# EAGLE design decoder (EAGLE 9.6.2)
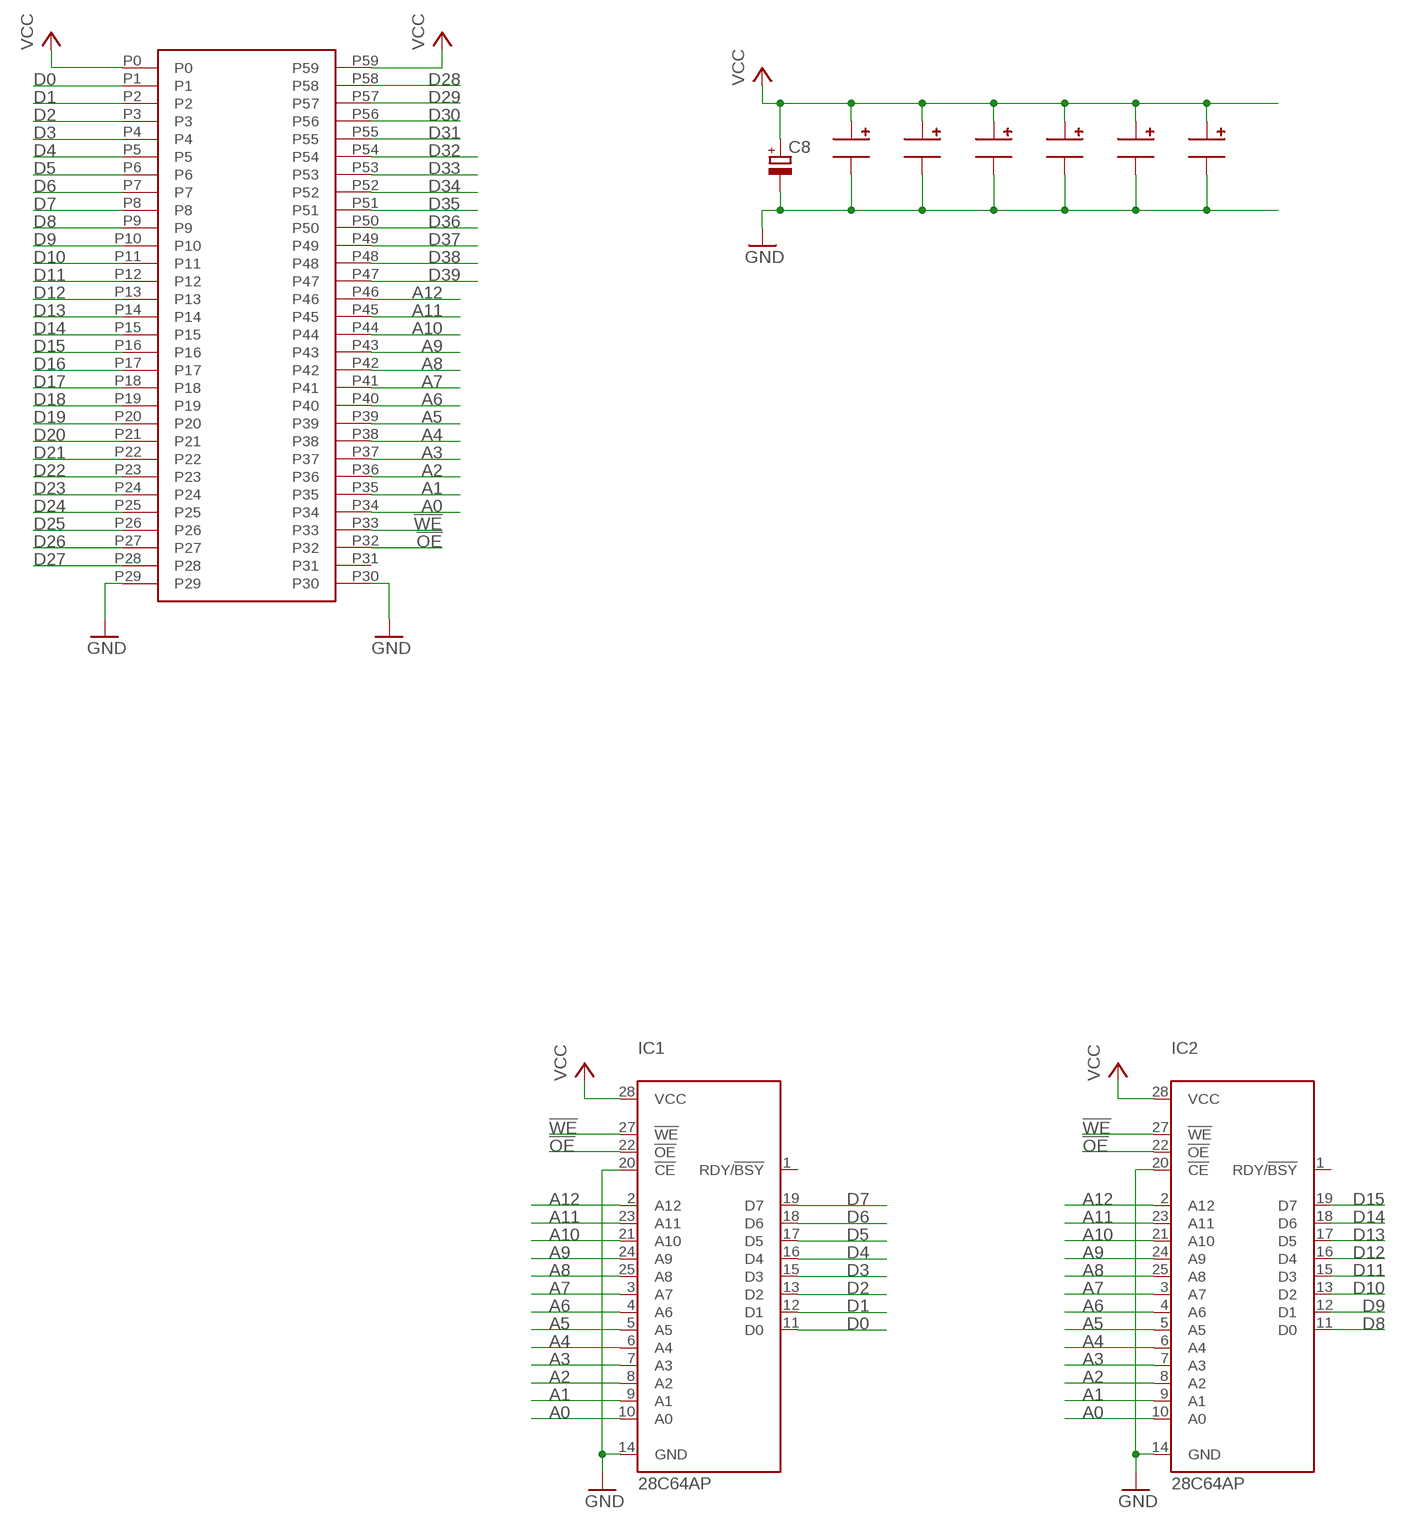
[diagram p0: schematic, sheet 1, part 1 of 2]
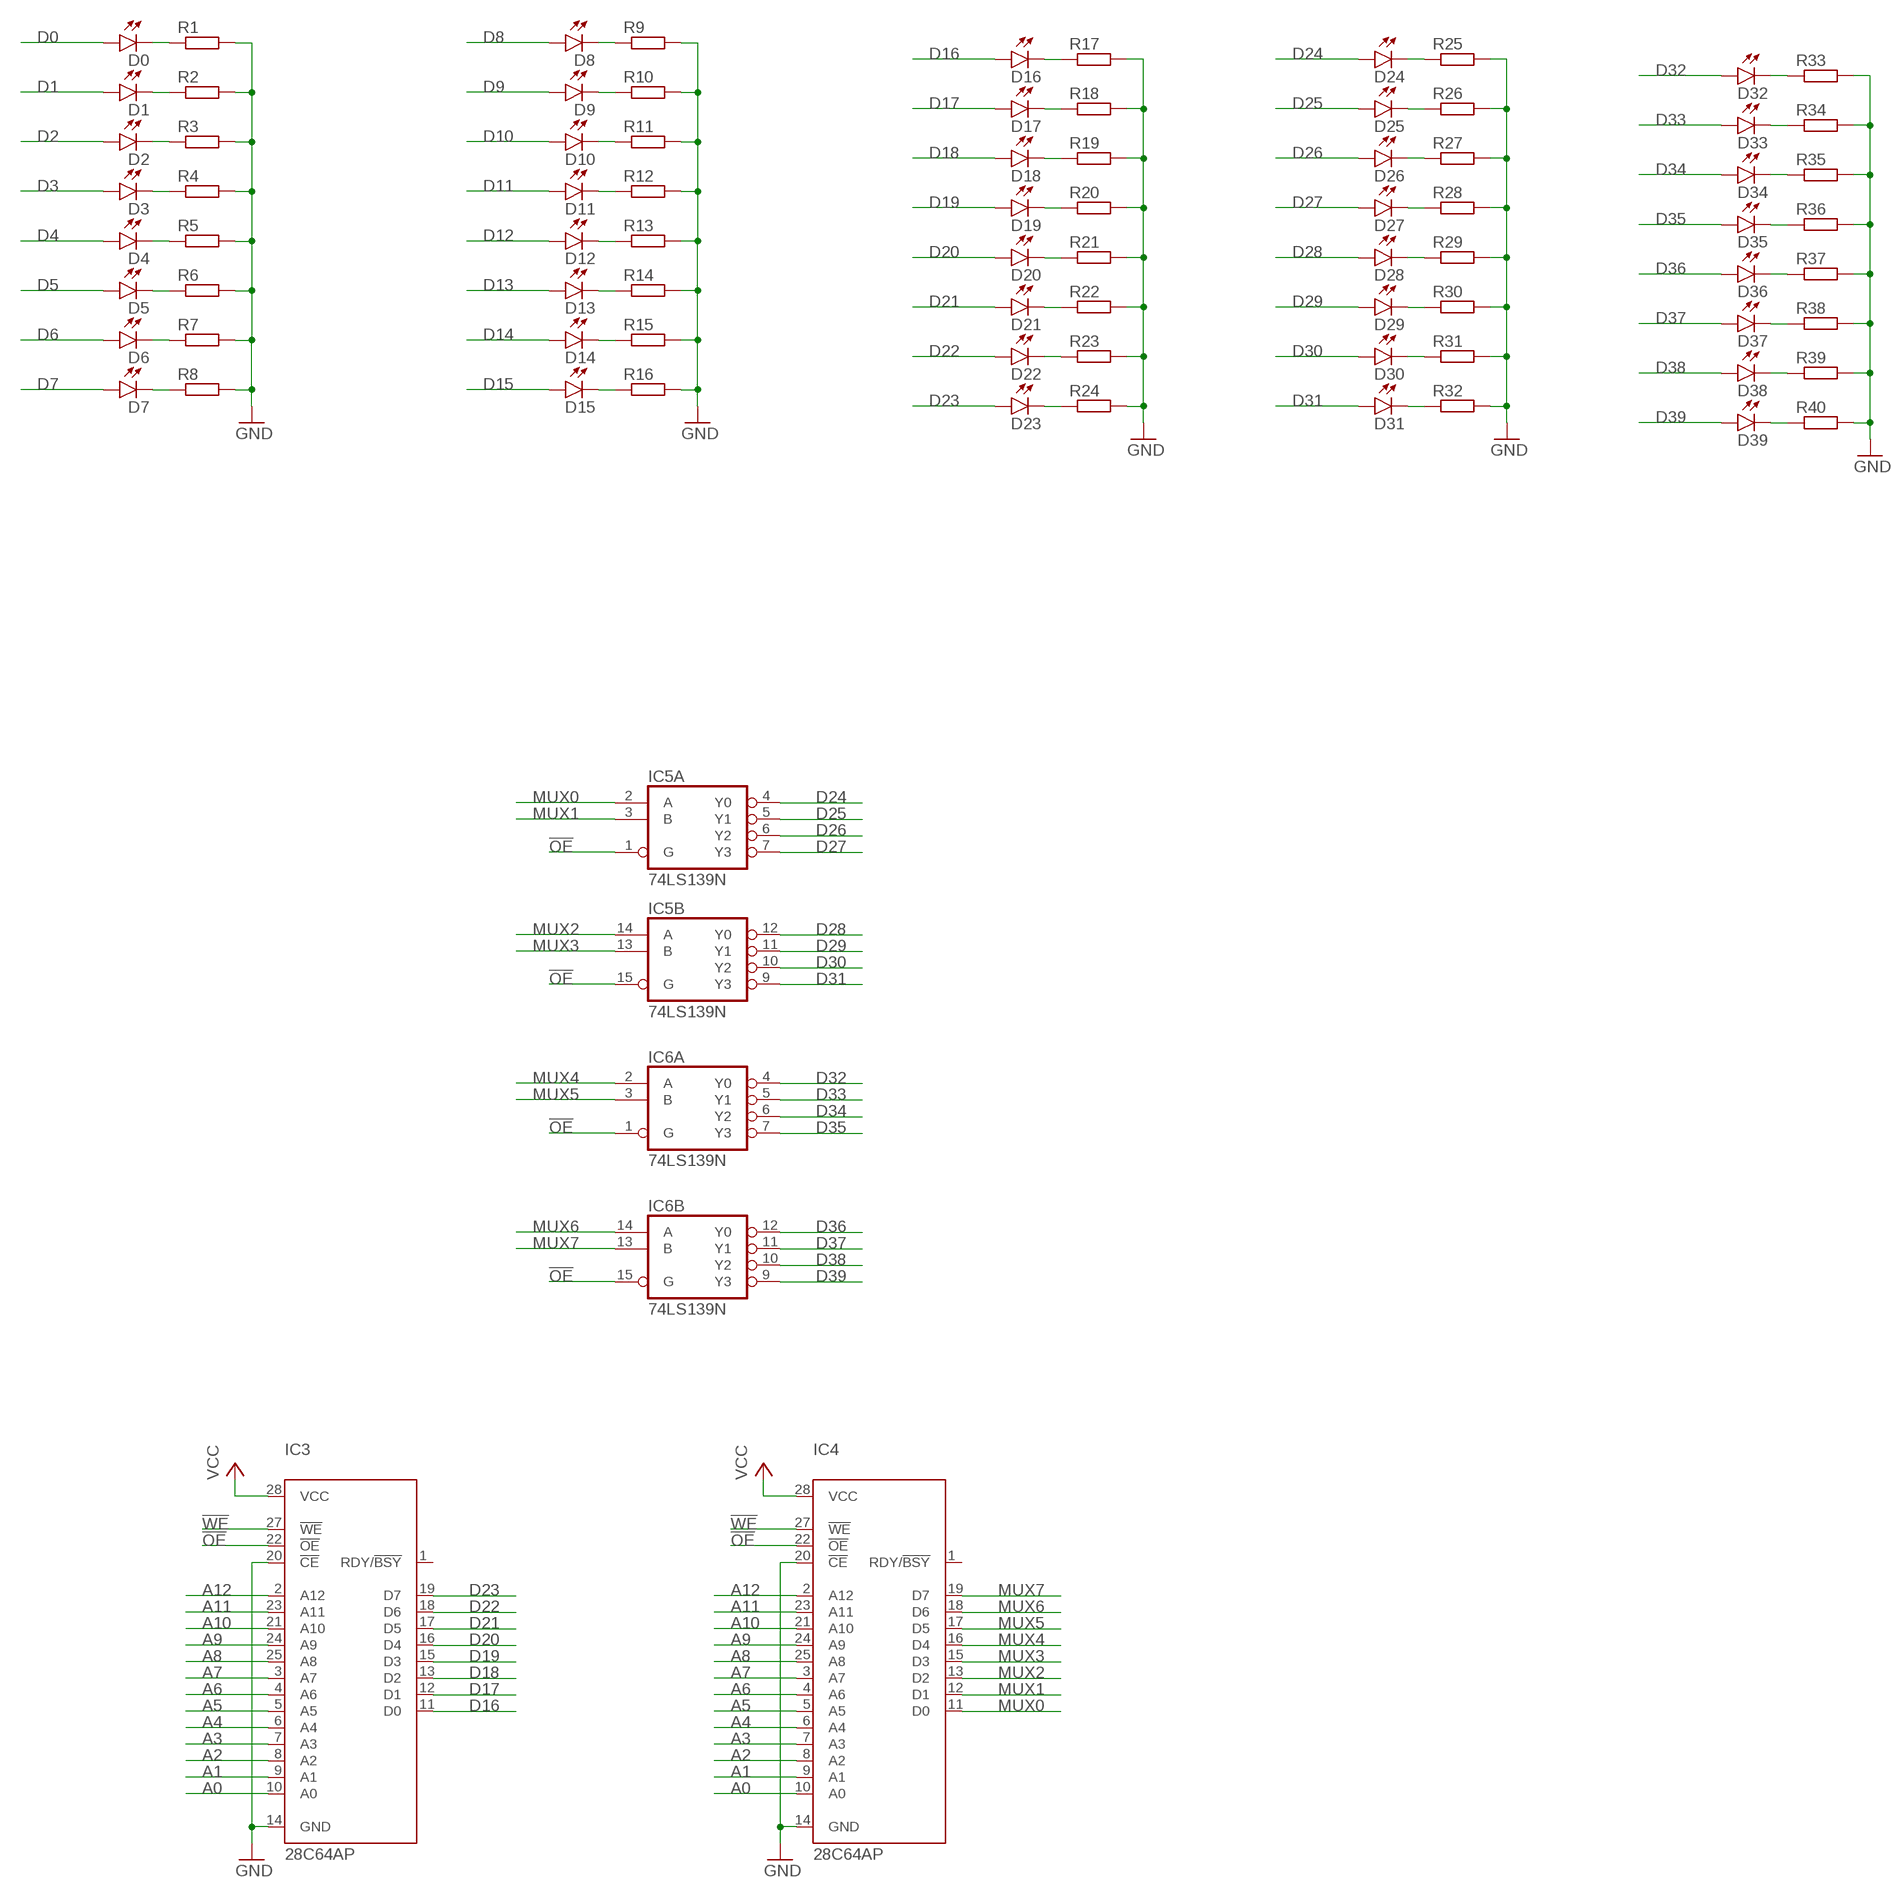
[diagram p1: schematic, sheet 1, part 2 of 2]

## Parts
C8  CPOL-EUE2,5-6E  [E2,5-6E]
D0  LEDSML1206  [SML1206]
D1  LEDSML1206  [SML1206]
D2  LEDSML1206  [SML1206]
D3  LEDSML1206  [SML1206]
D4  LEDSML1206  [SML1206]
D5  LEDSML1206  [SML1206]
D6  LEDSML1206  [SML1206]
D7  LEDSML1206  [SML1206]
D8  LEDSML1206  [SML1206]
D9  LEDSML1206  [SML1206]
D10  LEDSML1206  [SML1206]
D11  LEDSML1206  [SML1206]
D12  LEDSML1206  [SML1206]
D13  LEDSML1206  [SML1206]
D14  LEDSML1206  [SML1206]
D15  LEDSML1206  [SML1206]
D16  LEDSML1206  [SML1206]
D17  LEDSML1206  [SML1206]
D18  LEDSML1206  [SML1206]
D19  LEDSML1206  [SML1206]
D20  LEDSML1206  [SML1206]
D21  LEDSML1206  [SML1206]
D22  LEDSML1206  [SML1206]
D23  LEDSML1206  [SML1206]
D24  LEDSML1206  [SML1206]
D25  LEDSML1206  [SML1206]
D26  LEDSML1206  [SML1206]
D27  LEDSML1206  [SML1206]
D28  LEDSML1206  [SML1206]
D29  LEDSML1206  [SML1206]
D30  LEDSML1206  [SML1206]
D31  LEDSML1206  [SML1206]
D32  LEDSML1206  [SML1206]
D33  LEDSML1206  [SML1206]
D34  LEDSML1206  [SML1206]
D35  LEDSML1206  [SML1206]
D36  LEDSML1206  [SML1206]
D37  LEDSML1206  [SML1206]
D38  LEDSML1206  [SML1206]
D39  LEDSML1206  [SML1206]
IC1  28C64AP  [DIL28-6]
IC2  28C64AP  [DIL28-6]
IC3  28C64AP  [DIL28-6]
IC4  28C64AP  [DIL28-6]
IC5  74LS139N  [DIL16]
IC6  74LS139N  [DIL16]
R1  R-EU_R0805  [R0805]
R2  R-EU_R0805  [R0805]
R3  R-EU_R0805  [R0805]
R4  R-EU_R0805  [R0805]
R5  R-EU_R0805  [R0805]
R6  R-EU_R0805  [R0805]
R7  R-EU_R0805  [R0805]
R8  R-EU_R0805  [R0805]
R9  R-EU_R0805  [R0805]
R10  R-EU_R0805  [R0805]
R11  R-EU_R0805  [R0805]
R12  R-EU_R0805  [R0805]
R13  R-EU_R0805  [R0805]
R14  R-EU_R0805  [R0805]
R15  R-EU_R0805  [R0805]
R16  R-EU_R0805  [R0805]
R17  R-EU_R0805  [R0805]
R18  R-EU_R0805  [R0805]
R19  R-EU_R0805  [R0805]
R20  R-EU_R0805  [R0805]
R21  R-EU_R0805  [R0805]
R22  R-EU_R0805  [R0805]
R23  R-EU_R0805  [R0805]
R24  R-EU_R0805  [R0805]
R25  R-EU_R0805  [R0805]
R26  R-EU_R0805  [R0805]
R27  R-EU_R0805  [R0805]
R28  R-EU_R0805  [R0805]
R29  R-EU_R0805  [R0805]
R30  R-EU_R0805  [R0805]
R31  R-EU_R0805  [R0805]
R32  R-EU_R0805  [R0805]
R33  R-EU_R0805  [R0805]
R34  R-EU_R0805  [R0805]
R35  R-EU_R0805  [R0805]
R36  R-EU_R0805  [R0805]
R37  R-EU_R0805  [R0805]
R38  R-EU_R0805  [R0805]
R39  R-EU_R0805  [R0805]
R40  R-EU_R0805  [R0805]
U$1  2X60  [2X60]
U$2  CAP  [CAP]
U$3  CAP  [CAP]
U$4  CAP  [CAP]
U$5  CAP  [CAP]
U$6  CAP  [CAP]
U$7  CAP  [CAP]

## Nets
!OE: IC1.22(!OE) IC2.22(!OE) IC3.22(!OE) IC4.22(!OE) IC5.1(A:G) IC5.15(B:G) IC6.1(A:G) IC6.15(B:G) U$1.P32
!WE: IC1.27(!WE) IC2.27(!WE) IC3.27(!WE) IC4.27(!WE) U$1.P33
A0: IC1.10(A0) IC2.10(A0) IC3.10(A0) IC4.10(A0) U$1.P34
A1: IC1.9(A1) IC2.9(A1) IC3.9(A1) IC4.9(A1) U$1.P35
A2: IC1.8(A2) IC2.8(A2) IC3.8(A2) IC4.8(A2) U$1.P36
A3: IC1.7(A3) IC2.7(A3) IC3.7(A3) IC4.7(A3) U$1.P37
A4: IC1.6(A4) IC2.6(A4) IC3.6(A4) IC4.6(A4) U$1.P38
A5: IC1.5(A5) IC2.5(A5) IC3.5(A5) IC4.5(A5) U$1.P39
A6: IC1.4(A6) IC2.4(A6) IC3.4(A6) IC4.4(A6) U$1.P40
A7: IC1.3(A7) IC2.3(A7) IC3.3(A7) IC4.3(A7) U$1.P41
A8: IC1.25(A8) IC2.25(A8) IC3.25(A8) IC4.25(A8) U$1.P42
A9: IC1.24(A9) IC2.24(A9) IC3.24(A9) IC4.24(A9) U$1.P43
A10: IC1.21(A10) IC2.21(A10) IC3.21(A10) IC4.21(A10) U$1.P44
A11: IC1.23(A11) IC2.23(A11) IC3.23(A11) IC4.23(A11) U$1.P45
A12: IC1.2(A12) IC2.2(A12) IC3.2(A12) IC4.2(A12) U$1.P46
D0: D0.A IC1.11(D0) U$1.P1
D1: D1.A IC1.12(D1) U$1.P2
D2: D2.A IC1.13(D2) U$1.P3
D3: D3.A IC1.15(D3) U$1.P4
D4: D4.A IC1.16(D4) U$1.P5
D5: D5.A IC1.17(D5) U$1.P6
D6: D6.A IC1.18(D6) U$1.P7
D7: D7.A IC1.19(D7) U$1.P8
D8: D8.A IC2.11(D0) U$1.P9
D9: D9.A IC2.12(D1) U$1.P10
D10: D10.A IC2.13(D2) U$1.P11
D11: D11.A IC2.15(D3) U$1.P12
D12: D12.A IC2.16(D4) U$1.P13
D13: D13.A IC2.17(D5) U$1.P14
D14: D14.A IC2.18(D6) U$1.P15
D15: D15.A IC2.19(D7) U$1.P16
D16: D16.A IC3.11(D0) U$1.P17
D17: D17.A IC3.12(D1) U$1.P18
D18: D18.A IC3.13(D2) U$1.P19
D19: D19.A IC3.15(D3) U$1.P20
D20: D20.A IC3.16(D4) U$1.P21
D21: D21.A IC3.17(D5) U$1.P22
D22: D22.A IC3.18(D6) U$1.P23
D23: D23.A IC3.19(D7) U$1.P24
D24: D24.A IC5.4(A:Y0) U$1.P25
D25: D25.A IC5.5(A:Y1) U$1.P26
D26: D26.A IC5.6(A:Y2) U$1.P27
D27: D27.A IC5.7(A:Y3) U$1.P28
D28: D28.A IC5.12(B:Y0) U$1.P58
D29: D29.A IC5.11(B:Y1) U$1.P57
D30: D30.A IC5.10(B:Y2) U$1.P56
D31: D31.A IC5.9(B:Y3) U$1.P55
D32: D32.A IC6.4(A:Y0) U$1.P54
D33: D33.A IC6.5(A:Y1) U$1.P53
D34: D34.A IC6.6(A:Y2) U$1.P52
D35: D35.A IC6.7(A:Y3) U$1.P51
D36: D36.A IC6.12(B:Y0) U$1.P50
D37: D37.A IC6.11(B:Y1) U$1.P49
D38: D38.A IC6.10(B:Y2) U$1.P48
D39: D39.A IC6.9(B:Y3) U$1.P47
GND [supply]: C8.- IC1.14(GND) IC1.20(!CE) IC2.14(GND) IC2.20(!CE) IC3.14(GND) IC3.20(!CE) IC4.14(GND) IC4.20(!CE) R1.2 R2.2 R3.2 R4.2 R5.2 R6.2 R7.2 R8.2 R9.2 R10.2 R11.2 R12.2 R13.2 R14.2 R15.2 R16.2 R17.2 R18.2 R19.2 R20.2 R21.2 R22.2 R23.2 R24.2 R25.2 R26.2 R27.2 R28.2 R29.2 R30.2 R31.2 R32.2 R33.2 R34.2 R35.2 R36.2 R37.2 R38.2 R39.2 R40.2 U$1.P29 U$1.P30 U$2.P- U$3.P- U$4.P- U$5.P- U$6.P- U$7.P-
MUX0: IC4.11(D0) IC5.2(A:A)
MUX1: IC4.12(D1) IC5.3(A:B)
MUX2: IC4.13(D2) IC5.14(B:A)
MUX3: IC4.15(D3) IC5.13(B:B)
MUX4: IC4.16(D4) IC6.2(A:A)
MUX5: IC4.17(D5) IC6.3(A:B)
MUX6: IC4.18(D6) IC6.14(B:A)
MUX7: IC4.19(D7) IC6.13(B:B)
N$1: D0.C R1.1
N$2: D1.C R2.1
N$3: D2.C R3.1
N$4: D3.C R4.1
N$5: D4.C R5.1
N$6: D5.C R6.1
N$7: D6.C R7.1
N$8: D7.C R8.1
N$9: D8.C R9.1
N$10: D9.C R10.1
N$11: D10.C R11.1
N$12: D11.C R12.1
N$13: D32.C R33.1
N$14: D33.C R34.1
N$15: D12.C R13.1
N$16: D13.C R14.1
N$17: D14.C R15.1
N$18: D15.C R16.1
N$19: D16.C R17.1
N$20: D17.C R18.1
N$21: D18.C R19.1
N$22: D19.C R20.1
N$23: D20.C R21.1
N$24: D34.C R35.1
N$25: D35.C R36.1
N$26: D23.C R24.1
N$27: D22.C R23.1
N$28: D21.C R22.1
N$29: D36.C R37.1
N$30: D37.C R38.1
N$31: D38.C R39.1
N$32: D39.C R40.1
N$33: D24.C R25.1
N$34: D25.C R26.1
N$35: D26.C R27.1
N$36: D27.C R28.1
N$37: D28.C R29.1
N$38: D29.C R30.1
N$39: D30.C R31.1
N$40: D31.C R32.1
VCC [supply]: C8.+ IC1.28(VCC) IC2.28(VCC) IC3.28(VCC) IC4.28(VCC) U$1.P0 U$1.P59 U$2.P+ U$3.P+ U$4.P+ U$5.P+ U$6.P+ U$7.P+
Unconnected: IC1.1(RDY/!BSY) IC2.1(RDY/!BSY) IC3.1(RDY/!BSY) IC4.1(RDY/!BSY) U$1.P31

## Power pins joined to a net without a drawn wire
GND: IC5.8(P:GND) IC6.8(P:GND)
VCC: IC5.16(P:VCC) IC6.16(P:VCC)

## Library data of the parts
C8 = rcl:CPOL-EU: POLARIZED CAPACITOR, European symbol; SPICEPREFIX: C
D0 D1-D39 = led:LED: LED OSRAM: - CHIPLED LG R971, LG N971, LY N971, LG Q971, LY Q971, LO R971, LY R971 LH N974, LH R974 LS Q976, LO Q976, LY Q976 LO Q996 - Hyper CHIPLED LW Q18S LB Q993, LB Q99A, LB R99A - SideLED LS A670, LO A670, LY A670, LG A670, LP A670 LB A673, LV A673, LT A673, LW A673 LH A674 LY A675 LS A676, LA A676, LO A676, LY A676, LW A676 LS A679, LY A679, LG A679 - Hyper Micro SIDELED® LS Y876, LA Y876, LO Y876, LY Y876 LT Y87S - SmartLED LW L88C, LW L88S LB L89C, LB L89S, LG L890 LS L89K, LO L89K, LY L89K LS L896, LA L896, LO L896, LY L896 - TOPLED LS T670, LO T670, LY T670, LG T670, LP T670 LSG T670, LSP T670, LSY T670, LOP T670, LYG T670 LG T671, LOG T671, LSG T671 LB T673, LV T673, LT T673, LW T673 LH T674 LS T676, LA T676, LO T676, LY T676, LB T676, LH T676, LSB T676, LW T676 LB T67C, LV T67C, LT T67C, LS T67K, LO T67K, LY T67K, LW E67C LS E67B, LA E67B, LO E67B, LY E67B, LB E67C, LV E67C, LT E67C LW T67C LS T679, LY T679, LG T679 LS T770, LO T770, LY T770, LG T770, LP T770 LB T773, LV T773, LT T773, LW T773 LH T774 LS E675, LA E675, LY E675, LS T675 LS T776, LA T776, LO T776, LY T776, LB T776 LHGB T686 LT T68C, LB T68C - Hyper Mini TOPLED® LB M676 - Mini TOPLED Santana® LG M470 LS M47K, LO M47K, LY M47K Source: http://www.osram.convergy.de LUXEON: - LUMILED® LXK2-PW12-R00, LXK2-PW12-S00, LXK2-PW14-U00, LXK2-PW14-V00 LXK2-PM12-R00, LXK2-PM12-S00, LXK2-PM14-U00 LXK2-PE12-Q00, LXK2-PE12-R00, LXK2-PE12-S00, LXK2-PE14-T00, LXK2-PE14-U00 LXK2-PB12-K00, LXK2-PB12-L00, LXK2-PB12-M00, LXK2-PB14-N00, LXK2-PB14-P00, LXK2-PB14-Q00 LXK2-PR12-L00, LXK2-PR12-M00, LXK2-PR14-Q00, LXK2-PR14-R00 LXK2-PD12-Q00, LXK2-PD12-R00, LXK2-PD12-S00 LXK2-PH12-R00, LXK2-PH12-S00 LXK2-PL12-P00, LXK2-PL12-Q00, LXK2-PL12-R00 Source: www.luxeon.com KINGBRIGHT: KA-3528ASYC Source: www.kingbright.com
IC1-IC4 = microchip:28*64A: CMOS EEPROM 64 K (8 K x 8), low voltage; MPN: AT28C64B-15PU; OC_FARNELL: 1631144; OC_NEWARK: 96K6557
IC5 IC6 = 74xx-eu:74*139: Dual 2-line to 4-line DECODER/DEMULTIPLEXER
R1-R40 = rcl:R-EU_: RESISTOR, European symbol; SPICEPREFIX: R
U$1 = IsaacAlonso:2X60
U$2-U$7 = IsaacAlonso:CAP

## Net classes
0 default: clearance 0.205 mm
1 supply: width 0.381 mm

## Board
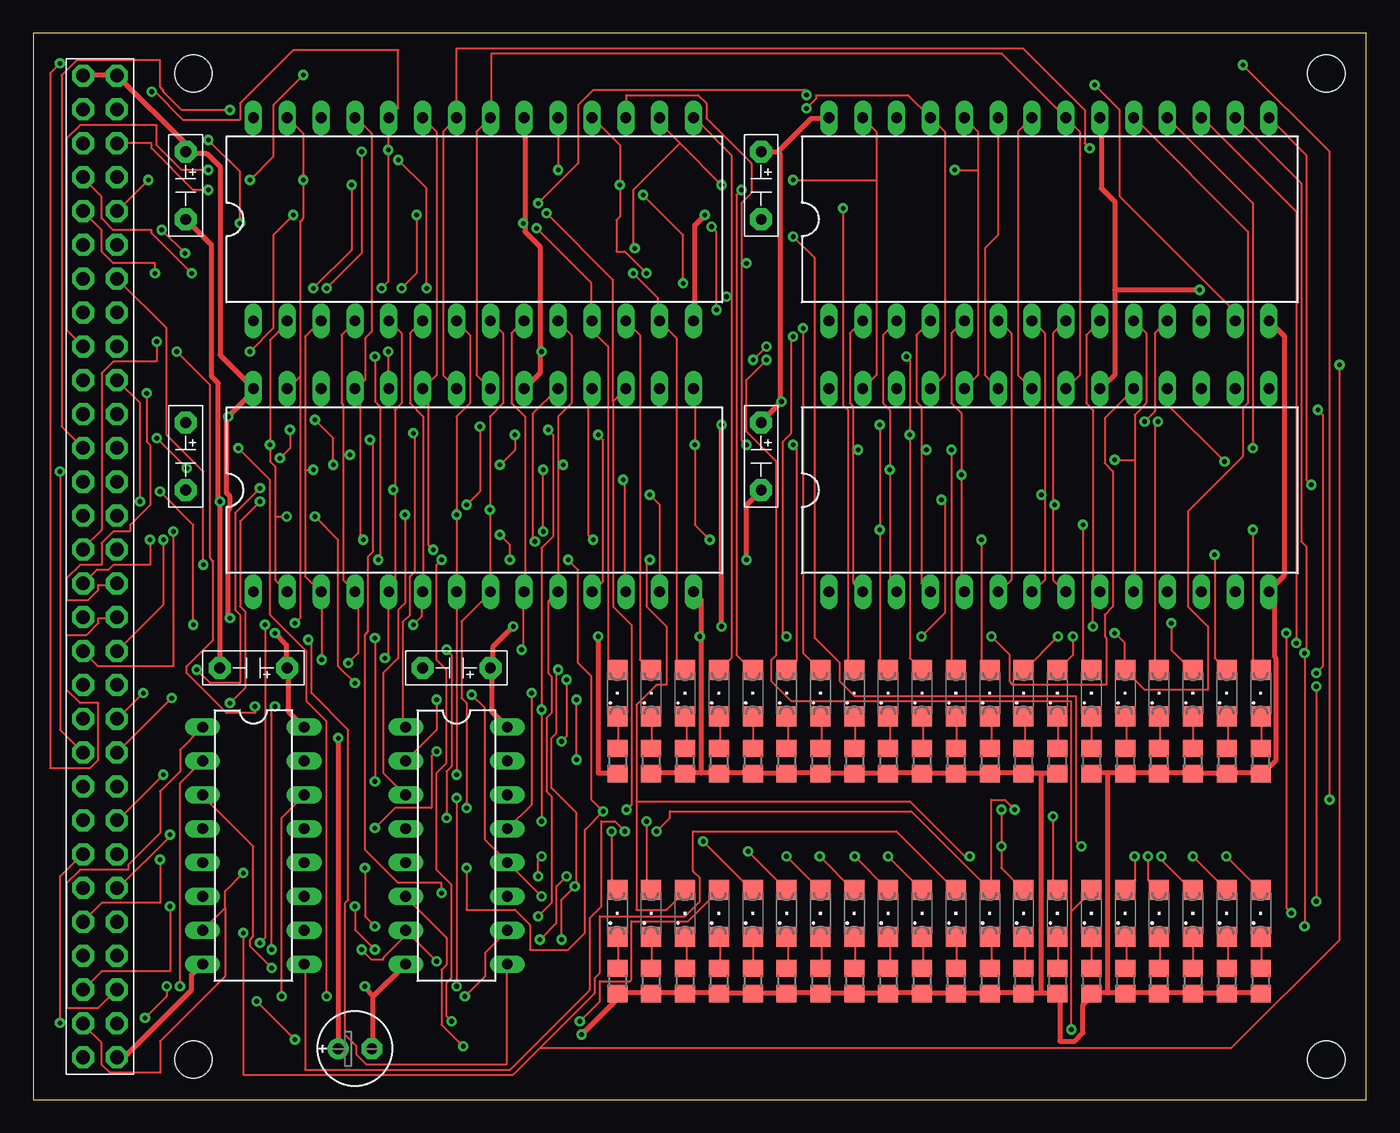
[diagram p2: board, top side]
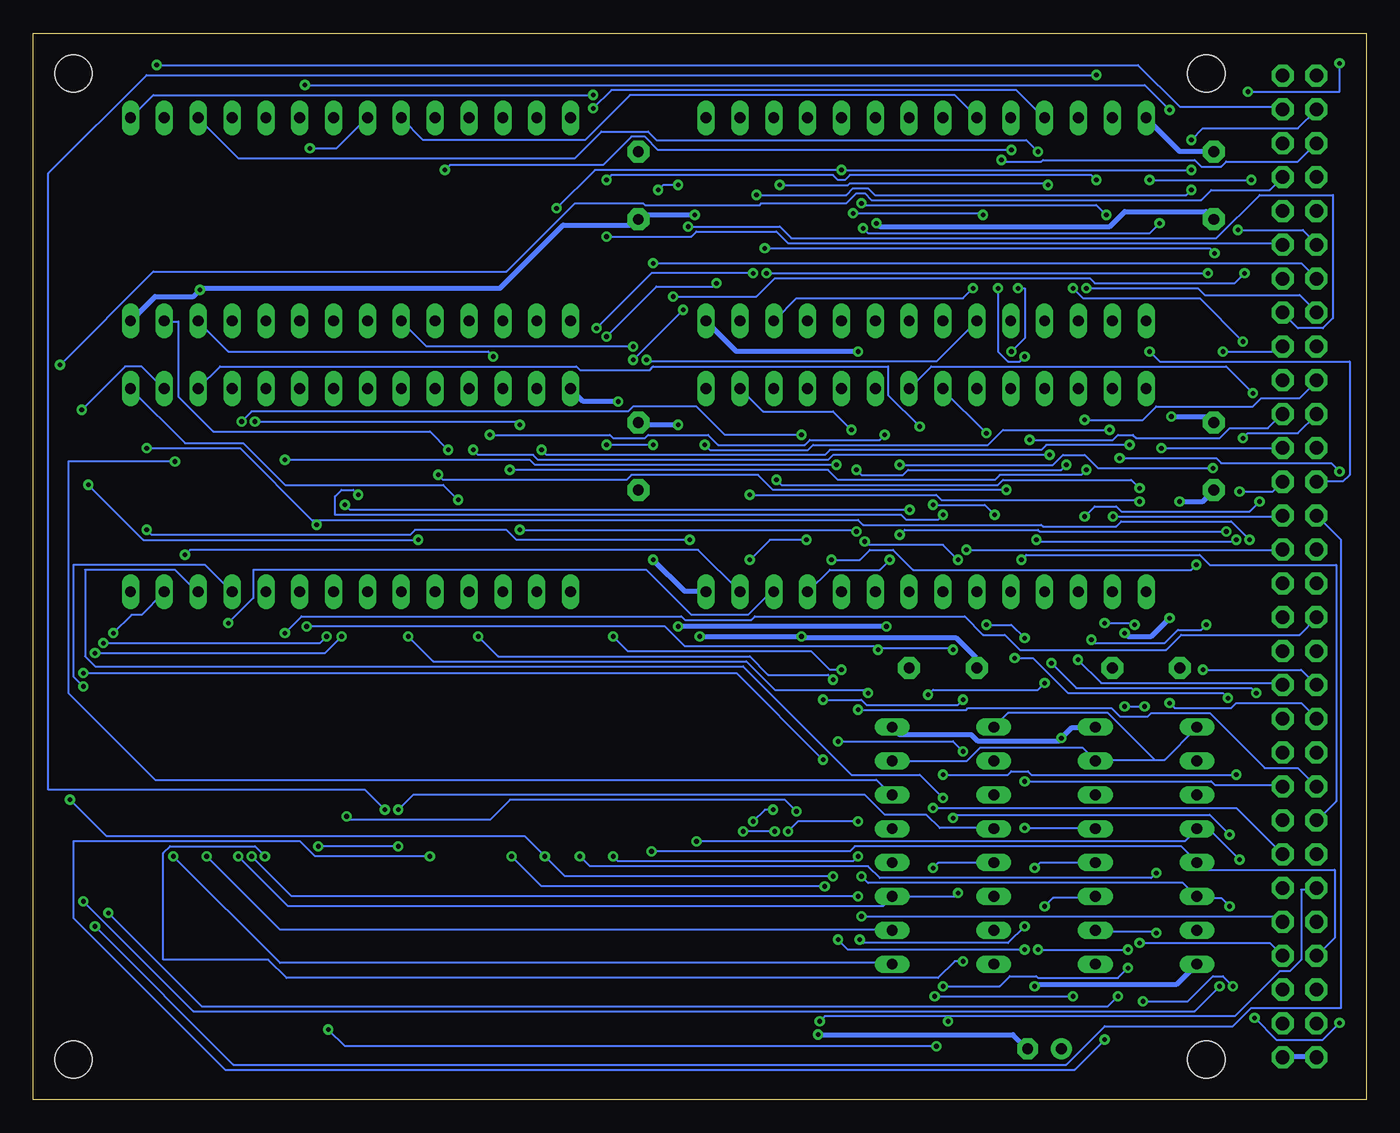
[diagram p3: board, bottom side, seen from below]

Size 100 x 80 mm. Coordinates in mm from the lower left corner, seen from the top.
Outline: 0,0 100,0 100,80 0,80 0,0
Copper layers (1*16): Top 0.035mm / dielectric 1.5mm / Bottom 0.035mm
Design rules "default": minimum track width 6mil, minimum drill 0.35mm, track to track 6mil, track to pad 6mil, pad to pad 6mil, via to via 6mil, smd to smd 6mil, copper to edge 40mil, drill to drill 6mil, minimum pad ring 10mil, minimum via ring 8mil, stop-mask expansion 4mil, vias tented up to drill 0mil, thermal gap 10mil
Holes 2.8 mm at 12,3 97,3 12,77 97,77
vRestrict: area 58.4,36.2 to 94,40; area 15.2,36.2 to 50.8,40; area 15.2,51.4 to 50.8,55.2; area 15.2,56.5 to 50.8,60.3; area 15.2,71.8 to 50.8,75.6; area 58.4,71.8 to 94,75.6; area 58.4,56.5 to 94,60.3; area 58.4,51.4 to 94,55.2; area 26,8.9 to 29.8,29.2; area 33.7,8.9 to 37.5,29.2; area 18.4,8.9 to 22.2,29.2; area 10.8,8.9 to 14.6,29.2; 7 more areas

### Footprints (pad centres in the part's own frame; a part is rotated, then mirrored left to right if it is on the bottom)
E2,5-6E = drill 0.813 pad 1.575: + -1.27,0 | drill 0.813 pad 1.575 octagon: - 1.27,0
SML1206 = smd 1.5 x 1.5: A 1.75,0; C -1.75,0
DIL28-6 = drill 0.813 long: 1 -16.51,-7.62; 2 -13.97,-7.62; 3 -11.43,-7.62; 4 -8.89,-7.62; 5 -6.35,-7.62; 6 -3.81,-7.62; 7 -1.27,-7.62; 8 1.27,-7.62; 9 3.81,-7.62; 10 6.35,-7.62; 11 8.89,-7.62; 12 11.43,-7.62; 13 13.97,-7.62; 14 16.51,-7.62; 15 16.51,7.62; 16 13.97,7.62; 17 11.43,7.62; 18 8.89,7.62; 19 6.35,7.62; 20 3.81,7.62; 21 1.27,7.62; 22 -1.27,7.62; 23 -3.81,7.62; 24 -6.35,7.62; 25 -8.89,7.62; 26 -11.43,7.62; 27 -13.97,7.62; 28 -16.51,7.62
DIL16 = drill 0.813 long: 1 -8.89,-3.81; 2 -6.35,-3.81; 3 -3.81,-3.81; 4 -1.27,-3.81; 5 1.27,-3.81; 6 3.81,-3.81; 7 6.35,-3.81; 8 8.89,-3.81; 9 8.89,3.81; 10 6.35,3.81; 11 3.81,3.81; 12 1.27,3.81; 13 -1.27,3.81; 14 -3.81,3.81; 15 -6.35,3.81; 16 -8.89,3.81
R0805 = smd 1.3 x 1.5: 1 -0.95,0; 2 0.95,0
2X60 = drill 1.016 pad 1.651 octagon: P0 -1.27,36.83; P1 -1.27,34.29; P2 -1.27,31.75; P3 -1.27,29.21; P4 -1.27,26.67; P5 -1.27,24.13; P6 -1.27,21.59; P7 -1.27,19.05; P8 -1.27,16.51; P9 -1.27,13.97; P10 -1.27,11.43; P11 -1.27,8.89; P12 -1.27,6.35; P13 -1.27,3.81; P14 -1.27,1.27; P15 -1.27,-1.27; P16 -1.27,-3.81; P17 -1.27,-6.35; P18 -1.27,-8.89; P19 -1.27,-11.43; P20 -1.27,-13.97; P21 -1.27,-16.51; P22 -1.27,-19.05; P23 -1.27,-21.59; P24 -1.27,-24.13; P25 -1.27,-26.67; P26 -1.27,-29.21; P27 -1.27,-31.75; P28 -1.27,-34.29; P29 -1.27,-36.83; P30 1.27,-36.83; P31 1.27,-34.29; P32 1.27,-31.75; P33 1.27,-29.21; P34 1.27,-26.67; P35 1.27,-24.13; P36 1.27,-21.59; P37 1.27,-19.05; P38 1.27,-16.51; P39 1.27,-13.97; P40 1.27,-11.43; P41 1.27,-8.89; P42 1.27,-6.35; P43 1.27,-3.81; P44 1.27,-1.27; P45 1.27,1.27; P46 1.27,3.81; P47 1.27,6.35; P48 1.27,8.89; P49 1.27,11.43; P50 1.27,13.97; P51 1.27,16.51; P52 1.27,19.05; P53 1.27,21.59; P54 1.27,24.13; P55 1.27,26.67; P56 1.27,29.21; P57 1.27,31.75; P58 1.27,34.29; P59 1.27,36.83
CAP = drill 0.813 pad 1.651 octagon: P+ 0,2.54; P- 0,-2.54

### Placement (x,y rotation side)
C8  24.13,3.81 0 top
D0  43.81,30.48 90 top
D1  46.35,30.48 90 top
D2  48.9,30.48 90 top
D3  51.44,30.48 90 top
D4  53.98,30.48 90 top
D5  56.52,30.48 90 top
D6  59.05,30.48 90 top
D7  61.59,30.48 90 top
D8  64.14,30.48 90 top
D9  66.67,30.48 90 top
D10  69.22,30.48 90 top
D11  71.75,30.48 90 top
D12  74.3,30.48 90 top
D13  76.83,30.48 90 top
D14  79.38,30.48 90 top
D15  81.92,30.48 90 top
D16  84.45,30.48 90 top
D17  87,30.48 90 top
D18  89.53,30.48 90 top
D19  92.08,30.48 90 top
D20  43.81,13.97 90 top
D21  46.35,13.97 90 top
D22  48.9,13.97 90 top
D23  51.44,13.97 90 top
D24  53.98,13.97 90 top
D25  56.52,13.97 90 top
D26  59.05,13.97 90 top
D27  61.59,13.97 90 top
D28  64.14,13.97 90 top
D29  66.67,13.97 90 top
D30  69.22,13.97 90 top
D31  71.75,13.97 90 top
D32  74.3,13.97 90 top
D33  76.83,13.97 90 top
D34  79.38,13.97 90 top
D35  81.92,13.97 90 top
D36  84.45,13.97 90 top
D37  87,13.97 90 top
D38  89.53,13.97 90 top
D39  92.08,13.97 90 top
IC1  33.02,66.04 0 top
IC2  76.2,66.04 0 top
IC3  33.02,45.72 0 top
IC4  76.2,45.72 0 top
IC5  16.51,19.05 270 top
IC6  31.75,19.05 270 top
R1  43.81,25.4 270 top
R2  46.35,25.4 270 top
R3  48.9,25.4 270 top
R4  51.44,25.4 270 top
R5  53.98,25.4 270 top
R6  56.52,25.4 270 top
R7  59.05,25.4 270 top
R8  61.59,25.4 270 top
R9  64.14,25.4 270 top
R10  66.67,25.4 270 top
R11  69.22,25.4 270 top
R12  71.75,25.4 270 top
R13  74.3,25.4 270 top
R14  76.83,25.4 270 top
R15  79.38,25.4 270 top
R16  81.92,25.4 270 top
R17  84.45,25.4 270 top
R18  87,25.4 270 top
R19  89.53,25.4 270 top
R20  92.08,25.4 270 top
R21  43.81,8.89 270 top
R22  46.35,8.89 270 top
R23  48.9,8.89 270 top
R24  51.44,8.89 270 top
R25  53.98,8.89 270 top
R26  56.52,8.89 270 top
R27  59.05,8.89 270 top
R28  61.59,8.89 270 top
R29  64.14,8.89 270 top
R30  66.67,8.89 270 top
R31  69.22,8.89 270 top
R32  71.75,8.89 270 top
R33  74.3,8.89 270 top
R34  76.83,8.89 270 top
R35  79.38,8.89 270 top
R36  81.92,8.89 270 top
R37  84.45,8.89 270 top
R38  87,8.89 270 top
R39  89.53,8.89 270 top
R40  92.08,8.89 270 top
U$1  5,40 0 top
U$2  11.43,48.26 0 top
U$3  31.75,32.38 270 top
U$4  11.43,68.58 0 top
U$5  16.51,32.38 270 top
U$6  54.61,68.58 0 top
U$7  54.61,48.26 0 top

### Tracks (layer width: path | path; a pad name or v marks a point on that pad's centre or on a via)
!OE  (via drill 0.35)
  Top 0.152: IC4.22 74.88,53.38 73.88,54.38 73.88,72.62 74.88,73.62 IC2.22 | IC3.22 31.75,53.38 30.75,54.38 30.75,72.62 31.75,73.62 IC1.22 31.75,78.88 74.25,78.88 78.88,74.25 78.88,71.75 v79.25,71.38 | U$1.P32 6.25,8.25 4.88,6.88 2.5,6.88 2.5,16.25 3.5,17.25 7.12,17.25 7.12,17.62 9.5,20 9.5,23.12 11,24.62 11,26.25 12.62,27.88 IC5.1 | v28.5,50 28.62,49.88 28.62,39.62 28.25,39.25 28.25,36.38 27.75,35.88 27.75,28.12 27.88,28 IC6.1
  Bottom 0.152: 15.88,25.5 20.25,25.5 IC5.15 20.38,25.5 21.25,26.38 29,26.38 30,25.38 35.5,25.38 IC6.15 | 15.88,25.5 15.12,25.5 12.75,27.88 IC5.1 | 15.88,25.5 19.38,29 26.88,29 27.88,28 IC6.1 | v28.5,50 31.75,53.25 IC3.22 | v79.25,71.38 77.25,71.38 75,73.62 IC2.22
!WE  (via drill 0.35)
  Top 0.152: 63.25,69 63.25,72.62 62.25,73.62 IC2.27 | 63.25,69 63.25,54.38 62.25,53.38 IC4.27 | 20,54.25 19.12,53.38 IC3.27 | 20,54.25 20,65.88 20.25,66.12 v20.25,69 20.25,72.5 19.12,73.62 IC1.27 | v17,11.75 17.38,12.12 v17.38,35.62 | v19.62,35.75 20,36.12 20,54.25 | v57,69 63.25,69
  Bottom 0.152: v17,11.75 7.25,11.75 6.38,10.88 U$1.P33 | v17.38,35.62 17.5,35.75 v19.62,35.75 | v57,69 56.62,69.38 40,69.38 39.62,69 39.12,69 38.75,69.38 20.62,69.38 v20.25,69
A0  (via drill 0.35)
  Top 0.152: 82.62,48 82.62,51.38 83.5,52.25 83.5,57.5 82.62,58.38 IC2.10 | 82.62,48 82.62,38.12 IC4.10 | 39.38,47.62 39.38,51.25 40.38,52.25 40.38,57.38 39.38,58.38 IC1.10 | 39.38,47.62 39.38,38.12 IC3.10 39.25,38 38.62,37.38 38.62,32 38.88,31.75 38.88,29 38.5,28.62 38.5,23.12 38.88,22.75 38.88,14.75 v37.88,13.75 | v81.12,48 82.62,48 | 39.38,47.62 v39.75,47.62
  Bottom 0.152: v37.88,13.75 6.75,13.75 6.38,13.38 U$1.P34 | v81.12,48 62.75,48 62.38,47.62 v39.75,47.62
A1  (via drill 0.35)
  Top 0.152: IC2.9 80,58.38 79,57.38 79,52.25 79.5,51.75 79.5,38.62 80,38.12 IC4.9 80,38 79.5,37.5 v79.5,35.5 | IC1.9 36.75,58.38 35.88,57.5 35.88,52.25 36.88,51.25 36.88,38.12 IC3.9 36.75,38 36.75,33.88 v36.62,33.75 | v10.25,19.88 10.25,19.75 6.38,15.88 U$1.P35 | v31,21.12 31,24.62 31.38,25 31.38,33.38 v31,33.75
  Bottom 0.152: v10.25,19.88 11.75,21.38 30.75,21.38 v31,21.12 | v31,33.75 31.12,33.88 36.5,33.88 v36.62,33.75 36.88,34 51.12,34 52.62,35.5 v79.5,35.5
A2  (via drill 0.35)
  Top 0.152: 76.5,44.62 76.5,57.5 77.38,58.38 IC2.8 | 76.5,44.62 76.5,39 77.38,38.12 IC4.8 | IC1.8 34.38,58.38 35.25,57.5 35.25,52.25 34.25,51.25 v34.25,44.25 34.25,38.12 IC3.8 34.25,38 32.12,35.88 32.12,30.12 32.5,29.75 v32.5,21.88 | v76.62,44.62 76.5,44.62
  Bottom 0.152: v32.5,21.88 9.75,21.88 6.38,18.5 U$1.P36 | v76.62,44.62 76.25,44.25 v34.25,44.25
A3  (via drill 0.35)
  Top 0.152: 75.88,45.38 75.88,57.5 75,58.38 IC2.7 | 75.88,45.38 75.88,39 75,38.12 IC4.7 | IC1.7 31.75,58.38 32.75,57.38 32.75,52.25 31.75,51.25 v31.75,43.88 IC3.7 v31.75,24.38 | v9.75,24.38 6.38,21 U$1.P37 | v75.62,45.38 75.88,45.38
  Bottom 0.152: v9.75,24.38 25.12,24.38 25.38,24.62 26.62,24.62 26.88,24.38 v31.75,24.38 | v75.62,45.38 76,45.75 76.88,45.75 77.38,45.25 77.38,43.88 34.88,43.88 34.5,43.5 32.12,43.5 v31.75,43.88
A4  (via drill 0.35)
  Top 0.152: IC4.6 72.5,38.12 73.38,39 73.38,57.5 72.5,58.38 IC2.6 | IC1.6 29.12,58.38 28.25,57.5 28.25,52.25 29.25,51.25 29.25,38.12 IC3.6 29.12,38 29.12,36.25 v28.5,35.62 | v25.62,34.62 v25.62,23.88 | v54,55.5 v55,56.5
  Bottom 0.152: v25.62,23.88 11.62,23.88 11.38,23.62 6.5,23.62 6.38,23.5 U$1.P38 | v25.62,34.62 26.62,35.62 v28.5,35.62 | v55,56.5 70.5,56.5 72.38,58.38 IC2.6 | v54,55.5 53.88,55.38 32.25,55.38 29.25,58.38 IC1.6
A5  (via drill 0.35)
  Top 0.152: IC4.5 69.75,38.12 69.62,38.25 v69.62,46.88 69.62,51.5 68.88,52.25 68.88,57.5 69.75,58.38 IC2.5 | 27.12,45.75 27.12,51.75 27.62,52.25 27.62,57.5 26.75,58.38 IC1.5 | 27.12,45.75 27.12,38.5 26.75,38.12 IC3.5 26.62,38 26.62,33.38 v26.38,33.12 | v10.38,30.12 6.38,26.12 U$1.P39 | 27.12,45.75 v27,45.75
  Bottom 0.152: v10.38,30.12 10.75,30.5 22.38,30.5 25,33.12 v26.38,33.12 | v69.62,46.88 69.25,46.5 55.5,46.5 55.12,46.88 45.62,46.88 44.5,45.75 v27,45.75
A6  (via drill 0.35)
  Top 0.152: 66.62,48.75 66.62,52 66.25,52.38 66.25,57.38 67.25,58.38 IC2.4 | 66.62,48.75 66.62,38.75 67.25,38.12 IC4.4 | 23.25,48.38 23.25,52.12 23.12,52.25 23.12,57.38 24.12,58.38 IC1.4 | 23.25,48.38 23.25,39 24.12,38.12 IC3.4 24.25,38 24.38,37.88 24.38,33.5 v23.62,32.75 | v8.25,30.5 6.38,28.62 U$1.P40 | v67,48.75 66.62,48.75 | 23.25,48.38 v23.75,48.38
  Bottom 0.152: v8.25,30.5 8.62,30.88 21.75,30.88 v23.62,32.75 | v67,48.75 66.62,48.38 62.5,48.38 62.12,48 40.38,48 40,48.38 v23.75,48.38
A7  (via drill 0.35)
  Top 0.152: IC4.3 64.75,38.12 64.25,38.62 v64.25,47.25 64.25,51.75 63.75,52.25 63.75,57.38 64.75,58.38 IC2.3 | 20.38,47.25 20.38,57.25 21.5,58.38 IC1.3 | 20.38,47.25 20.38,39.25 21.5,38.12 IC3.3 21.62,38 v21.62,33 | 20.38,47.25 v21,47.25
  Bottom 0.152: v21.62,33 19.88,31.25 6.5,31.25 6.38,31.12 U$1.P41 | v64.25,47.25 40.38,47.25 39.62,46.5 27.88,46.5 27.5,46.88 21.38,46.88 v21,47.25
A8  (via drill 0.35)
  Top 0.152: IC4.25 67.38,53.38 68.38,54.38 68.38,72.62 67.38,73.62 IC2.25 67.25,73.75 65.62,75.38 58.75,75.38 58.75,75.12 v58,74.38 | 24.5,53.62 24.88,54 24.88,57.12 25.38,57.62 25.38,72.5 24.25,73.62 IC1.25 | 24.5,53.62 24.25,53.38 IC3.25 24.5,53.62 | v9.75,42 9.75,37.12 6.38,33.75 U$1.P42 | v24.75,42 24.5,42.25 24.5,53.62
  Bottom 0.152: v9.75,42 9.88,41.88 24.62,41.88 v24.75,42 | v58,74.38 56.62,75.75 26.25,75.75 24.25,73.75 IC1.25
A9  (via drill 0.35)
  Top 0.152: 70.88,69.75 70.88,72.62 69.88,73.62 IC2.24 | 70.88,69.75 70.88,54.38 69.88,53.38 IC4.24 | v26.62,56.12 26.62,53.38 IC3.24 | v26.12,60.88 26.62,61.38 v26.62,71.25 26.62,73.62 IC1.24 26.75,73.75 27.38,74.38 27.38,78.75 19.5,78.75 15.5,74.75 15.5,73.5 11.25,73.5 9.12,75.62 v8.88,75.62 | v2,77.75 1.25,77 1.25,24.88 4.25,24.88 4.88,25.5 4.88,29.75 3.5,29.75 2.5,30.75 2.5,34.88 4,34.88 4.88,35.75 4.88,36.12 6.25,36.12 U$1.P43 | v69.12,69.75 70.88,69.75
  Bottom 0.152: v26.62,56.12 25.62,57.12 25.62,60.88 v26.12,60.88 | v2,77.75 2,75.62 v8.88,75.62 | v69.12,69.75 68.75,70.12 57.25,70.12 55.12,72.25 54.12,72.25 53.12,71.25 v26.62,71.25
A10  (via drill 0.35)
  Top 0.152: IC4.21 77.5,53.38 78.5,54.38 78.5,72.62 77.5,73.62 IC2.21 77.38,73.75 72.62,78.5 34.38,78.5 34.38,73.75 IC1.21 34.25,73.62 33.25,72.62 33.25,54.38 34.25,53.38 IC3.21 | v8.5,53 8.5,49.38 8.75,49.12 8.75,44.62 7.25,43.12 7.25,42.62 6,42.62 5.12,41.75 5.12,40.12 3.5,40.12 2.5,39.12 2.5,37.5 4.12,37.5 4.88,38.25 4.88,38.62 6.25,38.62 U$1.P44
  Bottom 0.152: v8.5,53 10.5,55 32.62,55 34.25,53.38 IC3.21
A11  (via drill 0.35)
  Top 0.152: IC4.23 72.38,53.38 71.38,54.38 71.38,63.88 72.38,64.88 72.38,73.62 IC2.23 | 29.62,53.75 30.25,54.38 30.25,72.62 29.25,73.62 IC1.23 | 29.62,53.75 29.25,53.38 IC3.23 29.62,53.75 | v30,41.25 29.62,41.62 29.62,53.75
  Bottom 0.152: v30,41.25 6.38,41.25 U$1.P45 | IC2.23 72.38,73.62 70.75,72 58.62,72 55.25,75.38 30.88,75.38 29.25,73.75 IC1.23
A12  (via drill 0.35)
  Top 0.152: 61.5,48.75 61.5,52 61.25,52.25 61.25,57.5 62.12,58.38 IC2.2 | 61.5,48.75 61.5,38.75 62.12,38.12 IC4.2 | 18.12,43.75 18.12,47.5 17.75,47.88 v17.75,49.12 17.75,57 19,58.25 19,58.38 IC1.2 | 18.12,43.75 18.12,39 19,38.12 IC3.2 | 18.12,43.75 v19,43.75 | v61.88,48.75 61.5,48.75
  Bottom 0.152: v19,43.75 6.38,43.75 U$1.P46 | v61.88,48.75 61.5,48.38 40.62,48.38 40.25,48.75 24.38,48.75 24,49.12 v17.75,49.12
D0  (via drill 0.35)
  Top 0.152: D0.A 43.75,32.25 43.12,32.88 43.12,56.5 42,57.62 42,58.38 IC1.11 41.88,58.5 41.88,61.25 v37.75,65.38 | v13.12,72 15.5,69.62 v15.5,65.75
  Bottom 0.152: v13.12,72 12.25,72.88 5.12,72.88 3.75,74.25 U$1.P1 | v15.5,65.75 16.25,65 37.38,65 v37.75,65.38
D1  (via drill 0.35)
  Top 0.152: D1.A 46.25,32.25 45.5,33 45.5,57.38 44.5,58.38 IC1.12 | v27.38,70.5 29.5,68.38 v29.5,60.88
  Bottom 0.152: v27.38,70.5 27.25,70.38 24.38,70.38 24.25,70.5 12.88,70.5 12.38,70 10.88,70 10.5,70.38 5.12,70.38 3.75,71.75 U$1.P2 | v29.5,60.88 30.25,60.12 42.75,60.12 44.38,58.5 IC1.12
D2  (via drill 0.35)
  Top 0.152: D2.A 48.25,32.88 48.25,57.12 47,58.38 IC1.13 46.88,58.5 46.88,60.12 v45,62 | v11.88,62 8.88,65 8.88,65.25 6,65.25 5.12,66.12 5.12,67.75 3.75,69.12 U$1.P3
  Bottom 0.152: v45,62 v11.88,62
D3  (via drill 0.35)
  Top 0.152: 52.38,60.25 52.38,70.88 49.62,73.62 IC1.15 | 52.38,60.25 52.38,33.12 51.5,32.25 D3.A | v9.12,62 9.12,62.75 6,62.75 5.12,63.62 5.12,65.25 3.75,66.62 U$1.P4 | 52.38,60.25 v52,60.25
  Bottom 0.152: v9.12,62 9.88,61.25 20.38,61.25 20.75,61.62 44.38,61.62 45.75,60.25 v52,60.25
D4  (via drill 0.35)
  Top 0.152: v53.12,68.25 52.75,67.88 52.75,33.38 53.88,32.25 D4.A | 48.5,71.75 47,73.25 47,73.62 IC1.16 | 48.5,71.75 v51.62,68.62 | v11.38,63.5 v9.62,65.25 | v45.12,63.88 45,64 45,68.25 48.5,71.75
  Bottom 0.152: v53.12,68.25 52.75,68.62 v51.62,68.62 | v9.62,65.25 4.75,65.25 3.75,64.25 U$1.P5 | v11.38,63.5 11.75,63.88 v45.12,63.88
D5  (via drill 0.35)
  Top 0.152: v57,49.12 57.25,48.88 57.25,32.88 56.62,32.25 D5.A | v53.5,49.12 53.12,49.5 53.12,62.75 | 53.12,62.75 53.12,67.25 53.88,68 53.88,70.25 50.5,73.62 50.5,74.75 49.88,75.38 44.5,75.38 44.5,73.75 IC1.17 | 53.12,62.75 v53.5,62.75
  Bottom 0.152: v53.5,49.12 v57,49.12 | v53.5,62.75 4.88,62.75 3.75,61.62 U$1.P6
D6  (via drill 0.35)
  Top 0.152: v57.75,57.88 57.75,33.5 59,32.25 D6.A | v46,62 44.38,63.62 43.75,63.62 43.75,66 44,66.25 v44,68.62 44,71.62 42,73.62 IC1.18 | v21,60.88 23.88,63.75 v23.88,68.62
  Bottom 0.152: v57.75,57.88 53.62,62 v46,62 | v21,60.88 12.62,60.88 12.12,60.38 5,60.38 3.75,59.12 U$1.P7 | v23.88,68.62 24,68.75 38.75,68.75 38.88,68.62 v44,68.62
D7  (via drill 0.35)
  Top 0.152: v60.75,66.88 60.75,52.12 61.12,51.75 61.12,32.62 61.5,32.25 D7.A | v39.38,69.75 39.38,73.62 IC1.19 | v13.12,69.75 11.12,69.75 9.25,71.62 9.25,73.12 3.5,73.12 2.5,72.12 2.5,57.75 3.62,56.62 U$1.P8
  Bottom 0.152: v60.75,66.88 57.88,69.75 v39.38,69.75 v13.12,69.75
D8  (via drill 0.35)
  Top 0.152: v63.5,50.62 v63.5,42.75 63.5,32.88 64.12,32.25 D8.A | v83.38,50.88 84.12,51.62 84.12,57.5 85,58.38 IC2.11 | v21.12,51 22.5,49.62 v22.5,47.62 | v38.25,42.62 v38.25,47.25
  Bottom 0.152: v63.5,50.62 63.75,50.88 v83.38,50.88 | v21.12,51 16.75,51 15.75,52 8.5,52 7.88,52.62 5,52.62 3.75,53.88 U$1.P9 | v22.5,47.62 22.88,47.25 34.38,47.25 34.75,46.88 37.88,46.88 v38.25,47.25 | v38.25,42.62 38.38,42.75 v63.5,42.75
D9  (via drill 0.35)
  Top 0.152: v65.5,55.75 65.75,55.5 v65.75,49.88 65.75,33.12 66.62,32.25 D9.A | v11.5,47.38 v9.25,49.62 | v35,47.62 36.12,48.75 v36.12,49.88
  Bottom 0.152: v65.5,55.75 65.88,56.12 85.38,56.12 87.62,58.38 IC2.12 | v9.25,49.62 8.88,50 5.12,50 3.75,51.38 U$1.P10 | v11.5,47.38 20.12,47.38 21.12,48.38 22.75,48.38 23.5,47.62 v35,47.62 | v36.12,49.88 36.5,49.5 41.75,49.5 42.12,49.12 48.62,49.12 49.38,49.88 53.88,49.88 54.12,49.62 56.5,49.62 56.75,49.88 v65.75,49.88
D10  (via drill 0.35)
  Top 0.152: v68.88,48.75 68.88,32.5 69.12,32.25 D10.A | v14.75,74.25 11.12,74.25 9.75,75.62 9.75,75.75 9.5,76 9.5,78 3.25,78 2.12,76.88 2.12,50.5 3.62,49 U$1.P11 | v79.62,76.12 81.5,74.25 81.5,67.75 90.12,59.12 90.12,58.5 IC2.13
  Bottom 0.152: v68.88,48.75 70.25,50.12 86.5,50.12 89.12,52.75 89.12,58.38 90.12,58.38 IC2.13 | v14.75,74.25 16.62,76.12 v79.62,76.12
D11  (via drill 0.35)
  Top 0.152: v71.12,42 71.12,32.88 71.75,32.25 D11.A | v95.88,46.12 95.5,46.5 95.5,70.88 92.75,73.62 IC2.15 | v16.25,56.12 18,57.88 18,64.88 v19.5,66.38 | v37.88,67.25 40.88,70.25 40.88,74.62 42,75.75 58,75.75 v58,75.38
  Bottom 0.152: v71.12,42 91.75,42 v95.88,46.12 | v16.25,56.12 15.5,55.38 1.25,55.38 1.25,46.88 1.75,46.38 3.62,46.38 U$1.P12 | v19.5,66.38 20.25,67.12 37.75,67.12 v37.88,67.25 | v58,75.38 91,75.38 92.62,73.75 IC2.15
D12  (via drill 0.35)
  Top 0.152: v76.88,34.75 74.38,32.25 D12.A | IC2.16 90.25,73.62 95.12,68.75 95.12,41.88 95.5,41.5 95.5,33.62 v95.38,33.5 v95.38,13
  Bottom 0.152: v76.88,34.75 78.12,33.5 v95.38,33.5 | v95.38,13 85,2.62 22.5,2.62 19.62,5.5 10,5.5 8.62,6.88 1.88,6.88 1.88,42 3.62,43.75 U$1.P13
D13  (via drill 0.35)
  Top 0.152: v78,34.75 78,33.38 76.88,32.25 D13.A | v94.75,34.25 94.75,66.62 87.75,73.62 IC2.17 | v9.25,56.88 9.25,55.38 6,55.38 5.12,54.5 5.12,42.75 3.75,41.38 U$1.P14 | v22,60.88 24.62,63.5 v24.62,71.12
  Bottom 0.152: v78,34.75 78.5,34.25 v94.75,34.25 | v9.25,56.88 12.5,60.12 21.25,60.12 v22,60.88 | v24.62,71.12 25.5,72 53.25,72 53.88,72.62 57.38,72.62 59.38,70.62 84.62,70.62 87.62,73.62 IC2.17
D14  (via drill 0.35)
  Top 0.152: v78.75,43.12 78.75,32.88 79.38,32.25 D14.A | v91.5,48.88 91.5,67.25 IC2.18 | U$1.P15 4.75,39.75 5.62,39.75 6,40.12 8.75,40.12 v8.75,42
  Bottom 0.152: 79.12,43.5 84.5,48.88 v91.5,48.88 | 79.12,43.5 v78.75,43.12 | v8.75,42 10.12,43.38 18.38,43.38 18.75,43 24.25,43 24.38,43.12 37.75,43.12 38.12,43.5 79.12,43.5
D15  (via drill 0.35)
  Top 0.152: IC2.19 82.62,73.62 91.12,65.12 91.12,52.25 90.75,51.88 90.75,48.25 86.62,44.12 86.62,37 88.12,35.5 88.12,30.75 83.38,30.75 82,32.12 D15.A 81.88,32.25 81.88,34.25 v81.12,35
  Bottom 0.152: v81.12,35 79.88,36.25 51.38,36.25 51.12,36 46.12,36 45.88,36.25 30.12,36.25 28.75,34.88 27.12,34.88 26,33.75 15,33.75 13.88,34.88 5,34.88 3.75,36.12 U$1.P16
D16  (via drill 0.35)
  Top 0.152: v84.38,50.88 84.12,50.62 84.12,32.5 84.38,32.25 D16.A | v42.38,49.88 42.75,49.5 42.75,38.88 42,38.12 IC3.11 | v10.5,42.62 10.5,32.5 4.88,32.5 3.75,33.62 U$1.P17 | v35,42.38 35.75,41.62 v35.75,40.5
  Bottom 0.152: v84.38,50.88 83.62,51.62 55.38,51.62 55,52 50.25,52 48.12,49.88 v42.38,49.88 | v10.5,42.62 24.5,42.62 24.62,42.75 34.62,42.75 v35,42.38 | v35.75,40.5 36.5,39.75 40.25,39.75 41.88,38.12 IC3.11
D17  (via drill 0.35)
  Top 0.152: v85.38,35.75 85.38,33.75 86.88,32.25 D17.A | v12.25,32.25 13.25,31.25 15.5,31.25 15.5,36.38 15.12,36.75 15.12,44 v17,45.88 | v44.25,46.5 44.38,46.38 44.38,38.12 IC3.12
  Bottom 0.152: v85.38,35.75 83.5,37.62 83.5,39.75 54,39.75 50.62,36.38 46.38,36.38 44.75,38 44.5,38 IC3.12 | v12.25,32.25 4.88,32.25 3.75,31.12 U$1.P18 | v17,45.88 17.62,46.5 27.25,46.5 27.62,46.12 43.88,46.12 v44.25,46.5
D18  (via drill 0.35)
  Top 0.152: v88.62,40.88 88.62,33.12 89.5,32.25 D18.A | v14.75,29.75 15.88,30.88 15.88,36.62 15.5,37 15.5,43.38 v17,44.88 | v46.25,45.38 47,44.62 47,38.12 IC3.13
  Bottom 0.152: v88.62,40.88 88.25,41.25 50.12,41.25 47,38.12 IC3.13 | v14.75,29.75 14.38,29.38 10.12,29.38 9.75,29.75 4.88,29.75 3.75,28.62 U$1.P19 | v17,44.88 17.12,45 31.88,45 32.25,45.38 v46.25,45.38
D19  (via drill 0.35)
  Top 0.152: v91.5,42.75 91.5,32.75 92,32.25 D19.A | v50.75,42 49.62,43.12 v49.62,49.12 49.62,53.25 IC3.15 | v2,47.12 2,27.75 3.62,26.12 U$1.P20 | v18.5,48.12 19.25,48.88 v19.25,50.25
  Bottom 0.152: v91.5,42.75 91.12,42.38 71.75,42.38 71.38,42.75 64.5,42.75 63.75,42 v50.75,42 | v2,47.12 2.62,47.75 10.88,47.75 11.25,48.12 v18.5,48.12 | v19.25,50.25 27.25,50.25 28.38,49.12 41.5,49.12 41.88,48.75 49.25,48.75 v49.62,49.12
D20  (via drill 0.35)
  Top 0.152: v43.38,20.12 43.38,16.12 43.75,15.75 D20.A | v38.12,20.88 v38.12,29.25 38.12,41.38 39,42.25 39,49.88 v38.62,50.25
  Bottom 0.152: v43.38,20.12 42.62,20.88 v38.12,20.88 | v38.62,50.25 40,51.62 45.25,51.62 46.88,53.25 IC3.16 | v38.12,29.25 30,29.25 29.88,29.38 19.12,29.38 18.5,28.75 16.38,28.75 16.12,29 11.75,29 7.62,24.88 5.12,24.88 3.75,23.5 U$1.P21
D21  (via drill 0.35)
  Top 0.152: v46,20.88 46,16 46.25,15.75 D21.A | v44.5,21.75 44.88,22.12 44.88,35.62 43.5,37 43.5,52.38 | 43.5,52.38 44.38,53.25 IC3.17 | v25.88,40.5 26,40.62 26,52 25.62,52.38 v25.62,55.75 | v27.62,60.88 28.75,62 v28.75,66.38 | v38.5,66.5 43.5,61.5 43.5,52.38
  Bottom 0.152: v46,20.88 45.12,21.75 v44.5,21.75 | v25.88,40.5 25.5,40.88 12.5,40.88 11.75,40.12 2.25,40.12 2.25,22.38 3.62,21 U$1.P22 | v25.62,55.75 26,55.38 26.88,55.38 27.62,56.12 v27.62,60.88 | v28.75,66.38 28.88,66.5 v38.5,66.5
D22  (via drill 0.35)
  Top 0.152: 45.25,22.38 45.25,29.62 46.75,31.12 47.5,31.12 47.5,35.5 46,37 46,40.25 v46.25,40.5 | 45.25,22.38 45.25,14.25 47.5,14.25 48.88,15.62 D22.A | v42,42 41.62,42.38 41.62,53 41.88,53.25 IC3.18 | v2,5.75 2,16.75 3.62,18.38 U$1.P23 | v8.38,6.12 10,7.75 v10,8.5 | v19.62,4.5 v16.75,7.38 | v70.25,18.25 69.88,18.25 65.75,22.38 45.25,22.38
  Bottom 0.152: v46.25,40.5 44.75,42 v42,42 | v2,5.75 3.25,4.5 6.75,4.5 v8.38,6.12 | v10,8.5 10.75,9.25 11.5,9.25 13.38,7.38 v16.75,7.38 | v19.62,4.5 21.88,2.25 85.62,2.25 97,13.62 97,19.38 80,19.38 78.88,18.25 v70.25,18.25
D23  (via drill 0.35)
  Top 0.152: v41,5.88 42.5,7.38 42.5,8.88 44.75,8.88 44.88,9 44.88,13.38 49.12,13.38 51.38,15.62 D23.A | v37.62,41.88 37.5,42 37.5,51.5 39.25,53.25 IC3.19 | v30.62,40.5 30.25,40.12 30.25,33 31,32.25 31,25.25 30.25,24.5 30.25,17.25 31.38,16.12 31.38,9.12 31,8.75 31,6.25 v31.38,5.88
  Bottom 0.152: v41,5.88 40.62,6.25 31.38,6.25 | 31.38,6.25 9.88,6.25 6.5,9.62 5.75,9.62 4.88,10.5 4.88,15.75 3.75,15.75 U$1.P24 | v37.62,41.88 37.38,41.62 31.75,41.62 v30.62,40.5 | 31.38,6.25 v31.38,5.88
D24  (via drill 0.35)
  Top 0.152: v50.25,19.38 53.88,15.75 D24.A | v9.5,18 9.5,14.75 5.12,14.75 3.75,13.38 U$1.P25
  Bottom 0.152: v50.25,19.38 13.62,19.38 12.75,20.25 IC5.4 12.62,20.25 11.75,20.25 v9.5,18
D25  (via drill 0.35)
  Top 0.152: v53.62,18.62 56.5,15.75 D25.A
  Bottom 0.152: v53.62,18.62 38.75,18.62 38.38,19 13.88,19 12.75,17.88 IC5.5 12.62,17.75 12.12,17.25 2.38,17.25 2.38,12.12 3.62,10.88 U$1.P26
D26  (via drill 0.35)
  Top 0.152: v56.5,18.25 59,15.75 D26.A | v38.12,18.25 37.88,18 v37.88,16.75 | v10.25,14.5 10.25,9.62 5.12,9.62 3.75,8.25 U$1.P27
  Bottom 0.152: v56.5,18.25 56.12,17.88 38.5,17.88 v38.12,18.25 | v37.88,16.75 37.38,16.25 13.75,16.25 12.75,15.25 IC5.6 12.62,15.12 10.88,15.12 v10.25,14.5
D27  (via drill 0.35)
  Top 0.152: v59,18.25 61.5,15.75 D27.A | v15.75,17 14.38,15.62 14.38,14.38 | IC5.7 14.38,14.38 | 14.38,14.38 14.38,9.25 9.5,4.38 9.5,2 5.75,2 5.12,2.62 5.12,4.25 3.75,5.62 U$1.P28
  Bottom 0.152: v59,18.25 58.25,17.5 37.38,17.5 36.5,16.62 16.12,16.62 v15.75,17
D28  (via drill 0.35)
  Top 0.152: v61.62,18.25 64.12,15.75 D28.A | v40,16.75 39.25,16 39.25,13.25 v38,12 | v25.62,13 24.88,13.75 v24.88,17.38 | v90.75,77.62 97.25,71.12 v97.25,22.5
  Bottom 0.152: v40,16.75 60.12,16.75 v61.62,18.25 63.12,19.75 94.5,19.75 v97.25,22.5 | v38,12 37.75,11.75 26.88,11.75 v25.62,13 | v24.88,17.38 24.5,17.75 20.38,17.75 IC5.12 | v90.75,77.62 17.12,77.62 14,74.5 6.5,74.5 6.38,74.38 U$1.P58
D29  (via drill 0.35)
  Top 0.152: v64.12,18.25 66.62,15.75 D29.A | v39.62,12 39.62,15 v40.62,16 40.75,16.12 40.75,21.5 38.88,23.38 38.88,27.12 39.25,27.5 39.25,32.12 v39.38,32.25 | v25.62,11.25 24.12,12.75 v24.12,14.5 | U$1.P57 8.88,71.75 8.88,71.38 12,68.25 v13.12,68.25 | v45.75,67.88 48.75,64.88 v48.75,61.25 | v57,57.25 56.88,57.12 56.88,50 56.25,49.38 56.25,35 v56.5,34.75
  Bottom 0.152: v64.12,18.25 61.88,16 v40.62,16 | v39.62,12 38.88,11.25 v25.62,11.25 | v24.12,14.5 23.5,15.12 20.38,15.12 IC5.11 | v13.12,68.25 13.5,67.88 36.88,67.88 37.38,68.38 38.5,68.38 39,67.88 v45.75,67.88 | v48.75,61.25 49,61 53.25,61 v57,57.25 | v56.5,34.75 55.38,33.62 41.62,33.62 40.25,32.25 v39.38,32.25
D30  (via drill 0.35)
  Top 0.152: 38,3.88 36,1.88 15.75,1.88 v15.75,12.5 | 38,3.88 42.12,8 42.12,9.12 42.5,9.5 42.5,13.75 48.88,13.75 50,14.88 50,16.62 49.5,17.12 49.5,20.12 64.75,20.12 69.12,15.75 D30.A | v98,55.12 98,12 89.88,3.88 38,3.88
  Bottom 0.152: v15.75,12.5 15.88,12.62 20.25,12.62 IC5.10 | v98,55.12 91,62.12 64.5,62.12 59.38,67.25 54.25,67.25 54.12,67.12 45.5,67.12 45.38,67.25 39,67.25 38.25,68 37.62,68 37.12,67.5 12.38,67.5 11.62,68.25 7.25,68.25 6.38,69.12 U$1.P56
D31  (via drill 0.35)
  Top 0.152: v46.75,20.12 47.75,21.12 47.75,21.62 65.88,21.62 71.75,15.75 D31.A 71.88,15.75 71.88,22.5 72.88,22.5 v73.62,21.75 | v44.38,20.12 43.62,20.88 42.62,20.88 42.62,14.5 41.75,13.62 41.75,8.25 35.75,2.25 20.38,2.25 20.38,10.12 IC5.9 | v8.62,69 6.38,66.75 U$1.P55 | v16.25,69 18,70.75 18,74.62 v20.25,76.88
  Bottom 0.152: v44.38,20.12 v46.75,20.12 | v16.25,69 v8.62,69 | v20.25,76.88 91.5,76.88 98.88,69.5 98.88,23.25 75.12,23.25 v73.62,21.75
D32  (via drill 0.35)
  Top 0.152: v72.62,21.75 v72.62,19 72.62,17.38 74.25,15.75 D32.A | v57,64.75 58.62,63.12 58.62,34.62 60.5,32.75 60.5,31.38 61.62,30.25 78.25,30.25 78.25,19.38 v78.62,19
  Bottom 0.152: v72.62,21.75 71.5,22.88 37.62,22.88 36.12,21.38 33,21.38 32,20.38 28,20.38 IC6.4 | v57,64.75 50.62,64.75 50.25,65.12 44.25,65.12 43.38,64.25 6.38,64.25 U$1.P54 | v72.62,19 v78.62,19
D33  (via drill 0.35)
  Top 0.152: v76.5,21.25 76.5,16 76.75,15.75 D33.A | v32.5,17.38 32.5,14.25 36.12,14.25 37.25,13.12 37.25,11.25 40.12,11.25 41.38,12.5 41.38,20.25 v42.75,21.62 41.88,22.5 41.88,31.75 40.88,32.75 40.88,39.75 v40.12,40.5 | v12.75,40.12 12.75,47.12 10,49.88 10,57.88 6.38,61.5 U$1.P53
  Bottom 0.152: v76.5,21.25 76.25,21 65.75,21 64.25,22.5 43.62,22.5 v42.75,21.62 | v32.5,17.38 32.12,17.75 28,17.75 IC6.5 | v12.75,40.12 13.12,39.75 34,39.75 35.5,41.25 37.25,41.25 38,40.5 v40.12,40.5
D34  (via drill 0.35)
  Top 0.152: 77.88,14.12 79.38,15.62 D34.A | v77.88,5.25 77.88,14.12 | v32.25,4 30.62,5.62 30.62,9.75 31,10.12 31,12.12 28,15.12 IC6.6 | v50.88,65.5 51.25,65.12 v51.25,59.25 | v55,55.5 53.5,54 53.5,50.12 55.75,47.88 55.75,33.38 55.38,33 55.38,31.38 56.88,29.88 77.88,29.88 77.88,14.12
  Bottom 0.152: v77.88,5.25 76.62,4 v32.25,4 | v50.88,65.5 44,65.5 43.12,64.62 11.25,64.62 8,67.88 2.5,67.88 2.5,58.62 3.25,57.88 5.12,57.88 6.25,59 U$1.P52 | v55,55.5 v51.25,59.25
D35  (via drill 0.35)
  Top 0.152: v82.62,18.25 82.62,16.38 82,15.75 D35.A | 28.12,12.5 28,12.62 IC6.7 28.12,12.5 | 28.12,12.5 v30.25,10.38 | v10.75,56.12 13.25,53.62 13.25,40.62 13.5,40.38 13.5,34.5 11.5,32.5 11.5,32 14.5,29 16.62,29 v16.62,29.5 | v18.12,29.5 17.88,29.25 v17.88,11.25 | v24.62,11.25 25.38,10.5 26.25,10.5 26.25,10.62 28.12,12.5
  Bottom 0.152: v82.62,18.25 83.38,19 89.75,19 90.25,18.5 90.25,10.5 82.38,10.5 81,9.12 32.12,9.12 30.88,10.38 v30.25,10.38 | v10.75,56.12 6.75,56.12 6.38,56.5 U$1.P51 | v18.12,29.5 v16.62,29.5 | v24.62,11.25 v17.88,11.25
D36  (via drill 0.35)
  Top 0.152: v83.62,18.25 83.62,16.5 84.38,15.75 D36.A | v38.12,15.25 35.62,17.75 IC6.12 35.5,17.88 33.88,19.5 33.88,29.38 v32.88,30.38 | v8,44.88 8,52.25 6.38,53.88 U$1.P50 | v21.12,43.75 22.88,42 22.88,32.5 v24.12,31.25
  Bottom 0.152: v83.62,18.25 80.62,15.25 v38.12,15.25 | v8,44.88 8.75,44.12 18.38,44.12 18.75,44.5 20.38,44.5 v21.12,43.75 | v24.12,31.25 24.62,30.75 32.5,30.75 v32.88,30.38
D37  (via drill 0.35)
  Top 0.152: v84.62,18.25 84.62,18 86.88,15.75 D37.A | v25.25,49.5 25.5,49.25 25.5,41.12 25.12,40.75 25.12,35.12 24.88,34.88 24.88,18.75 27.38,16.25 30.62,16.25 v30.62,15.5
  Bottom 0.152: v84.62,18.25 80.88,14.5 36.25,14.5 35.62,15.12 IC6.11 35.5,15.25 30.88,15.25 v30.62,15.5 | v25.25,49.5 19,49.5 18.62,49.88 17.5,49.88 17.25,49.62 11,49.62 10.25,50.38 7.38,50.38 6.38,51.38 U$1.P49
D38  (via drill 0.35)
  Top 0.152: v87,18.25 89.5,15.75 D38.A | v15.38,48.88 17.75,46.5 17.75,36.38 20.5,33.62 20.5,29.88 22,28.38 v22,7.75 | v32.38,7.75 33.88,9.25 33.88,11 35.5,12.62 IC6.10
  Bottom 0.152: v87,18.25 81.5,12.75 35.62,12.75 IC6.10 | v15.38,48.88 6.38,48.88 U$1.P48 | v32.38,7.75 v22,7.75
D39  (via drill 0.35)
  Top 0.152: v89.5,18.25 92,15.75 D39.A | v9.5,45.62 12,43.12 v12,35.62 | v20.62,34.5 20.88,34.25 20.88,30.5 23.62,27.75 23.62,15 23.38,14.75 23.38,4.88 24.25,4 24.25,3.38 25,2.62 35.5,2.62 35.5,10.12 IC6.9
  Bottom 0.152: v89.5,18.25 81.5,10.25 35.62,10.25 IC6.9 | v9.5,45.62 7,45.62 6.38,46.25 U$1.P47 | v12,35.62 12.38,35.25 14.12,35.25 15.12,34.25 20.38,34.25 v20.62,34.5
GND  (via drill 0.35)
  Top 0.381: U$5.P- 14,32.5 v14,44.88 13.88,45 13.88,53.75 13.38,54.25 13.38,64.12 11.5,66 U$4.P- | 38,56.12 38,64 36.88,65.12 36.88,65.75 | 38,56.12 38,54.5 36.88,53.38 IC3.20 | 36.88,65.75 36.88,73.62 IC1.20 | v38.12,56.12 38,56.12 | v50.38,66.38 49.62,65.62 49.62,58.5 IC1.14 | v36.75,65.75 36.88,65.75 | v42.38,34.75 42.38,24.5 43.75,24.5 R1.2 | 75.62,24.5 74.38,24.5 R13.2 74.25,24.5 71.88,24.5 R12.2 71.62,24.5 69.38,24.5 R11.2 69.12,24.5 66.75,24.5 R10.2 66.62,24.5 64.25,24.5 R9.2 64,24.5 61.75,24.5 R8.2 61.5,24.5 59.12,24.5 R7.2 59,24.5 56.62,24.5 R6.2 56.38,24.5 54.12,24.5 R5.2 53.88,24.5 51.5,24.5 R4.2 51.25,24.5 50.12,24.5 | 75.62,24.5 76.75,24.5 R14.2 | R2.2 46.38,24.5 48.88,24.5 R3.2 49,24.5 50.12,24.5 | 50.12,24.5 50.12,34.75 | 50.12,34.75 50.12,37.5 49.62,38 IC3.14 | v53.5,40.5 53.5,44.62 54.5,45.62 U$7.P- | v50,34.75 50.12,34.75 | 81.12,60.75 81.12,67.38 80.12,68.38 80.12,73.62 IC2.20 | 81.12,60.75 81.12,54.38 80.12,53.38 IC4.20 | 80.62,24.5 81.88,24.5 R16.2 82,24.5 84.38,24.5 R17.2 84.5,24.5 86.88,24.5 R18.2 87.12,24.5 89.38,24.5 R19.2 89.62,24.5 92,24.5 R20.2 92.25,24.5 93.25,25.5 93.25,33.12 93.12,33.25 93.12,37.62 92.75,38 IC4.14 92.75,38.25 93.88,39.38 93.88,57.25 92.75,58.38 IC2.14 | 80.62,24.5 79.38,24.5 R15.2 | v87.5,60.75 81.12,60.75 | 25.5,7.75 27.88,10.12 IC6.8 | 25.5,7.75 25.5,3.88 C8.- | IC5.8 12.62,10.12 11.88,9.38 11.88,8.25 6.88,3.25 6.38,3.25 U$1.P30 | 25.5,7.75 24.88,8.38 v24.88,8.5 | R40.2 92,8 89.62,8 R39.2 89.38,8 87.12,8 R38.2 86.88,8 84.5,8 R37.2 84.38,8 82,8 R36.2 81.88,8 80.62,8 | 80.62,8 79.38,8 R35.2 79.38,7.75 78.75,7.12 78.75,5 78.12,4.38 77,4.38 77,7.88 R34.2 76.75,8 75.62,8
  Top 0.381: 75.62,8 74.38,8 R33.2 74.25,8 71.88,8 R32.2 71.62,8 69.38,8 R31.2 69.12,8 66.75,8 R30.2 66.62,8 64.25,8 R29.2 64,8 61.75,8 R28.2 61.5,8 59.12,8 R27.2 59,8 56.62,8 R26.2 56.38,8 54.12,8 R25.2 53.88,8 51.62,8 R24.2 51.38,8 49,8 R23.2 48.75,8 46.5,8 R22.2 46.25,8 43.88,8 R21.2 43.75,7.75 43.75,7.5 v41.12,4.88 | 80.62,8 80.62,24.5 | 75.62,8 75.62,24.5
  Bottom 0.381: v14,44.88 12.25,44.88 11.5,45.62 U$2.P- | v38.12,56.12 47.25,56.12 49.5,58.38 IC1.14 | v50.38,66.38 54.25,66.38 54.5,66.12 U$6.P- 54.75,66 55.12,65.62 60.25,65.62 65,60.88 87.38,60.88 v87.5,60.75 88,60.25 90.88,60.25 92.62,58.5 IC2.14 | v36.75,65.75 36.5,65.5 19.25,65.5 18.12,66.62 12,66.62 11.5,66.12 U$4.P- | U$3.P- 29.25,32.5 29.25,33.12 30.75,34.62 42.25,34.62 v42.38,34.75 v50,34.75 | v53.5,40.5 51.12,38.12 49.62,38.12 IC3.14 | U$1.P29 3.75,3.25 6.25,3.25 U$1.P30 | v24.88,8.5 24.75,8.62 14.25,8.62 12.75,10.12 IC5.8 | v41.12,4.88 26.5,4.88 25.5,3.88 C8.-
MUX0  (via drill 0.35)
  Top 0.152: v11,8.5 11,23.75 12.62,25.38 IC5.2 | v96.25,31 v96.25,14.88
  Bottom 0.152: v11,8.5 12.88,6.62 88,6.62 v96.25,14.88 | v96.25,31 97,31.75 97,40.12 87.12,40.12 85.12,38.12 IC4.11
MUX1  (via drill 0.35)
  Top 0.152: v17.88,9.88 16.25,11.5 16.25,12 16.5,12.25 16.5,19 12.75,22.75 IC5.3 | v31.75,22.62 v31.75,8.5
  Bottom 0.152: v17.88,9.88 18.62,9.12 24.62,9.12 24.75,9.25 26.75,9.25 27.5,8.5 v31.75,8.5 | v31.75,22.62 33.5,24.38 38.62,24.38 46.75,32.5 95.38,32.5 96.12,33.25 96.12,39.75 89.38,39.75 87.75,38.12 IC4.12
MUX2  (via drill 0.35)
  Top 0.152: v18.62,7.75 18.62,21.12 20.25,22.75 IC5.14 | v94.38,14 94,14.38 v94,35
  Bottom 0.152: v18.62,7.75 19.38,7 87.38,7 v94.38,14 | v94,35 92.62,36.38 91.88,36.38 90.25,38 IC4.13
MUX3  (via drill 0.35)
  Top 0.152: v25.62,20.38 27.12,21.88 29.88,21.88 29.88,25.75 v30.25,26.12 | v39.62,26.88 40,27.25 v40,31.5 | v66.62,34.75 68.38,36.5 68.38,44.75 v68.12,45
  Bottom 0.152: v25.62,20.38 20.38,20.38 IC5.13 | v30.25,26.12 31,26.88 v39.62,26.88 | v40,31.5 40.38,31.88 44.88,31.88 46.25,33.25 65.12,33.25 v66.62,34.75 | v68.12,45 69.25,46.12 81.12,46.12 84.25,49.25 88.62,49.25 92.62,53.25 IC4.15
MUX4  (via drill 0.35)
  Top 0.152: v30.25,30 30.25,27.75 28,25.5 IC6.2 | v40.75,25.5 v40.75,30 | v96.25,32 96.75,32.5 96.75,51.38 v96.38,51.75
  Bottom 0.152: v30.25,30 30.62,29.62 37.5,29.62 37.88,30 v40.75,30 | v40.75,25.5 47.25,32 v96.25,32 | v96.38,51.75 93.12,55 91.88,55 90.25,53.38 IC4.16
MUX5  (via drill 0.35)
  Top 0.152: v27.88,43.88 27.88,37.25 27.38,36.75 27.38,33.12 26.25,32 26.25,24.5 27.88,22.88 IC6.3 | v32.5,44.62 33.5,45.62 v33.5,50.5
  Bottom 0.152: v27.88,43.88 28.62,44.62 v32.5,44.62 | v33.5,50.5 35.88,52.88 35.88,55 53.5,55 53.75,54.75 59,54.75 59.25,55 86,55 87.62,53.38 IC4.17
MUX6  (via drill 0.35)
  Top 0.152: v89.38,47.88 85.12,52.12 85.12,53.25 IC4.18
  Bottom 0.152: v89.38,47.88 97.38,47.88 97.38,30.5 90.88,24 36.75,24 35.62,22.88 IC6.14
MUX7  (via drill 0.35)
  Top 0.152: v37.38,30.5 37.38,22.12 35.62,20.38 IC6.13 | v71.88,34.75 73.25,33.38 73.25,31.38 73.5,31.12 80.5,31.12 80.5,34.62 80.38,34.75 80.38,36.38 81,37 81,47.12 80.38,47.75 80.38,51.12 82.5,53.25 IC4.19
  Bottom 0.152: v37.38,30.5 37.62,30.75 44.38,30.75 46.5,32.88 70,32.88 v71.88,34.75
N$1
  Top 0.152: R1.1 43.88,26.38 43.88,28.62 D0.C
N$2
  Top 0.152: R2.1 46.38,26.38 46.38,28.62 D1.C
N$3
  Top 0.152: R3.1 49,26.38 49,28.62 D2.C
N$4
  Top 0.152: R4.1 51.5,26.38 51.5,28.62 D3.C
N$5
  Top 0.152: R5.1 54,26.38 54,28.62 D4.C
N$6
  Top 0.152: R6.1 56.62,26.38 56.62,28.62 D5.C
N$7
  Top 0.152: R7.1 59.12,26.38 59.12,28.62 D6.C
N$8
  Top 0.152: R8.1 61.62,26.38 61.62,28.62 D7.C
N$9
  Top 0.152: R9.1 64.25,26.38 64.25,28.62 D8.C
N$10
  Top 0.152: R10.1 66.75,26.38 66.75,28.62 D9.C
N$11
  Top 0.152: R11.1 69.25,26.38 69.25,28.62 D10.C
N$12
  Top 0.152: R12.1 71.88,26.38 71.88,28.62 D11.C
N$13
  Top 0.152: R33.1 74.38,9.88 74.38,12.12 D32.C
N$14
  Top 0.152: R34.1 76.88,9.88 76.88,12.12 D33.C
N$15
  Top 0.152: R13.1 74.38,26.38 74.38,28.62 D12.C
N$16
  Top 0.152: R14.1 76.88,26.38 76.88,28.62 D13.C
N$17
  Top 0.152: D14.C R15.1
N$18
  Top 0.152: R16.1 82,26.38 82,28.62 D15.C
N$19
  Top 0.152: R17.1 84.5,26.38 84.5,28.62 D16.C
N$20
  Top 0.152: R18.1 87,26.38 87,28.62 D17.C
N$21
  Top 0.152: R19.1 89.62,26.38 89.62,28.62 D18.C
N$22
  Top 0.152: R20.1 92.12,26.38 92.12,28.62 D19.C
N$23
  Top 0.152: R21.1 43.88,9.88 43.88,12.12 D20.C
N$24
  Top 0.152: D34.C R35.1
N$25
  Top 0.152: R36.1 82,9.88 82,12.12 D35.C
N$26
  Top 0.152: R24.1 51.5,9.88 51.5,12.12 D23.C
N$27
  Top 0.152: R23.1 49,9.88 49,12.12 D22.C
N$28
  Top 0.152: R22.1 46.38,9.88 46.38,12.12 D21.C
N$29
  Top 0.152: R37.1 84.5,9.88 84.5,12.12 D36.C
N$30
  Top 0.152: R38.1 87,9.88 87,12.12 D37.C
N$31
  Top 0.152: R39.1 89.62,9.88 89.62,12.12 D38.C
N$32
  Top 0.152: R40.1 92.12,9.88 92.12,12.12 D39.C
N$33
  Top 0.152: R25.1 54,9.88 54,12.12 D24.C
N$34
  Top 0.152: R26.1 56.62,9.88 56.62,12.12 D25.C
N$35
  Top 0.152: R27.1 59.12,9.88 59.12,12.12 D26.C
N$36
  Top 0.152: R28.1 61.62,9.88 61.62,12.12 D27.C
N$37
  Top 0.152: R29.1 64.25,9.88 64.25,12.12 D28.C
N$38
  Top 0.152: R30.1 66.75,9.88 66.75,12.12 D29.C
N$39
  Top 0.152: R31.1 69.25,9.88 69.25,12.12 D30.C
N$40
  Top 0.152: R32.1 71.88,9.88 71.88,12.12 D31.C
VCC  (via drill 0.35)
  Top 0.381: U$1.P0 3.75,76.88 6.25,76.88 U$1.P59 6.38,76.75 11.38,71.75 11.38,71.25 U$4.P+ 11.5,71 13,71 14,70 14,55.88 16.5,53.38 IC3.28 16.38,53.25 16.38,53 v14.62,51.25 14.5,51.12 14.5,45.5 14.75,45.25 14.75,44.38 14.62,44.25 14.62,36.25 v14.75,36.12 | U$7.P+ 54.62,50.88 v56.12,52.38 56,52.5 56,71 55.88,71.12 | 55.88,71.12 58.38,73.62 59.62,73.62 IC2.28 | 55.88,71.12 54.62,71.12 U$6.P+ | IC6.16 34.38,29.12 34.38,32.38 U$3.P+ 34.5,32.5 34.5,34 v36,35.5 | IC5.16 20.25,28 19.12,29.12 19.12,32.38 U$5.P+ 19,32.5 19,34.12 v18.12,35 | v22.88,27.12 22.88,3.88 C8.+ | v51.62,35.5 v51.62,50.62
  Bottom 0.381: IC1.28 16.5,73.62 14,71.12 11.5,71.12 U$4.P+ | v14.62,51.25 11.88,51.25 11.5,50.88 U$2.P+ | v56.12,52.38 58.75,52.38 59.62,53.25 IC4.28 | IC5.16 20.38,27.88 22.12,27.88 v22.88,27.12 23.12,26.88 29.12,26.88 29.62,27.38 35,27.38 35.5,27.88 IC6.16 | v51.62,50.62 54.38,50.62 54.5,50.75 U$7.P+ | v36,35.5 v51.62,35.5 | v14.75,36.12 16.12,34.75 17.88,34.75 v18.12,35